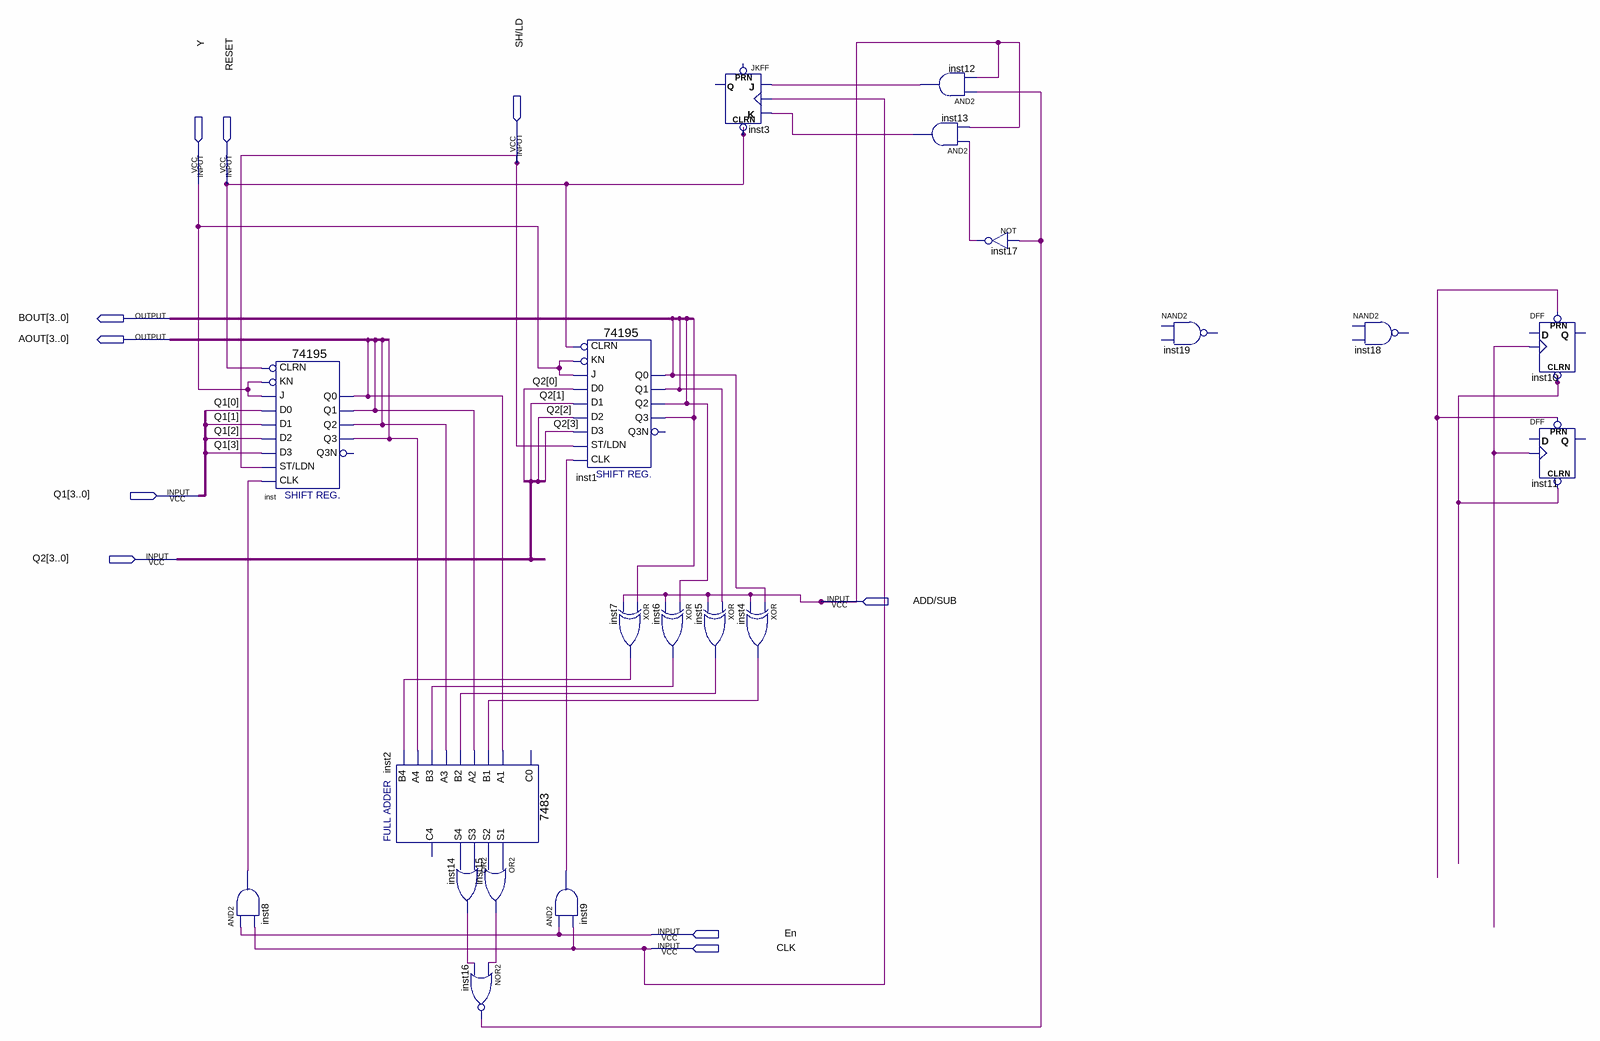
[diagram p0: schematic sheet]
// Quartus schematic ea03.bdf as structural Verilog: 20 symbols, 10 pins
module ea03 (
  input  \SH/LD ,
  input  Y,
  input  RESET,
  input  [3:0] Q1,
  input  [3:0] Q2,
  input  \ADD/SUB ,
  input  En,
  input  CLK,
  output [3:0] BOUT,
  output [3:0] AOUT
);

  wire inst1_q0, inst1_q1, inst1_q2, inst1_q3, inst2_s1, inst2_s2, inst2_s3, inst2_s4, inst4_out, inst5_out,
       inst6_out, inst7_out, inst8_out, inst9_out, inst12_out, inst13_out, inst14_out, inst15_out,
       inst16_out, inst17_out, inst_q0, inst_q1, inst_q2, inst_q3, undriven, undriven_2, undriven_3;

  and inst8 (inst8_out, En, CLK);
  \74195  inst (
    .\ST/LDN (\SH/LD ), .KN(Y), .CLRN(RESET), .D2(Q1[2]), .D1(Q1[1]), .D0(Q1[0]), .J(Y), .CLK(inst8_out),
    .D3(Q1[3]), .Q3(inst_q3), .Q0(inst_q0), .Q1(inst_q1), .Q2(inst_q2));  // open: Q3N
  \7483  inst2 (
    .B4(inst7_out), .A1(inst_q0), .A2(inst_q1), .B1(inst4_out), .B2(inst5_out), .A3(inst_q2), .B3(inst6_out),
    .A4(inst_q3), .S3(inst2_s3), .S4(inst2_s4), .S2(inst2_s2), .S1(inst2_s1));  // open: C0, C4
  or inst14 (inst14_out, inst2_s3, inst2_s4);
  nor inst16 (inst16_out, inst15_out, inst14_out);
  or inst15 (inst15_out, inst2_s1, inst2_s2);
  \74195  inst1 (
    .\ST/LDN (\SH/LD ), .KN(Y), .CLRN(RESET), .D2(Q2[2]), .D1(Q2[1]), .D0(Q2[0]), .J(Y), .CLK(inst9_out),
    .D3(Q2[3]), .Q3(inst1_q3), .Q0(inst1_q0), .Q1(inst1_q1), .Q2(inst1_q2));  // open: Q3N
  and inst9 (inst9_out, En, CLK);
  xor inst7 (inst7_out, inst1_q3, \ADD/SUB );
  xor inst6 (inst6_out, inst1_q2, \ADD/SUB );
  JKFF inst3 (.CLRN(RESET), .K(inst13_out), .J(inst12_out), .CLK(CLK));  // open: PRN, Q
  xor inst4 (inst4_out, inst1_q0, \ADD/SUB );
  xor inst5 (inst5_out, inst1_q1, \ADD/SUB );
  and inst13 (inst13_out, inst17_out, \ADD/SUB );
  and inst12 (inst12_out, inst16_out, \ADD/SUB );
  not inst17 (inst17_out, inst16_out);
  // NAND2 inst19 is placed but not wired
  // NAND2 inst18 is placed but not wired
  DFF inst10 (.CLRN(undriven_2), .CLK(undriven), .PRN(undriven_3));  // open: D, Q
  DFF inst11 (.CLRN(undriven_2), .CLK(undriven), .PRN(undriven_3));  // open: D, Q
endmodule
